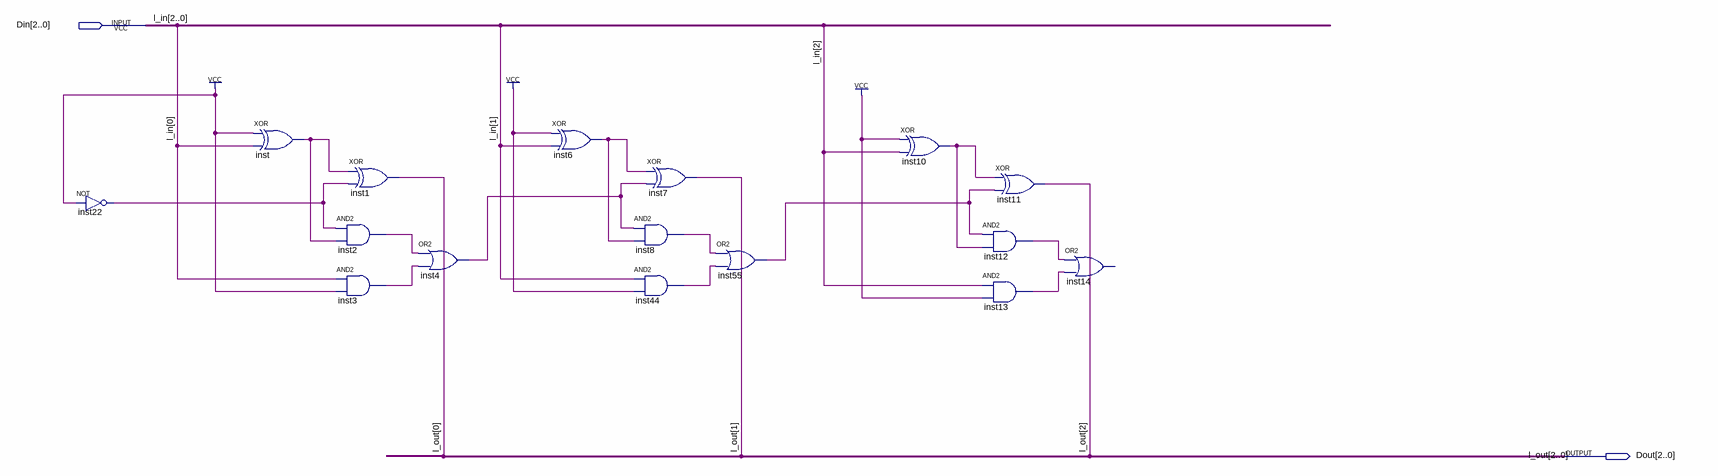
[diagram p0: schematic sheet]
// Quartus schematic decre_3bit.bdf as structural Verilog: 16 symbols, 2 pins
module decre_3bit (
  input  [2:0] Din,
  output [2:0] Dout
);

  wire inst2_out, inst3_out, inst4_out, inst6_out, inst8_out, inst10_out, inst12_out, inst13_out, inst22_out,
       inst44_out, inst55_out, inst_out;

  not inst22 (inst22_out, 1'b1);
  xor inst (inst_out, 1'b1, Din[0]);
  xor inst1 (Dout[0], inst_out, inst22_out);
  and inst2 (inst2_out, inst22_out, inst_out);
  and inst3 (inst3_out, Din[0], 1'b1);
  or inst4 (inst4_out, inst2_out, inst3_out);
  xor inst6 (inst6_out, 1'b1, Din[1]);
  and inst8 (inst8_out, inst4_out, inst6_out);
  and inst44 (inst44_out, Din[1], 1'b1);
  xor inst7 (Dout[1], inst6_out, inst4_out);
  or inst55 (inst55_out, inst8_out, inst44_out);
  xor inst10 (inst10_out, 1'b1, Din[2]);
  and inst12 (inst12_out, inst55_out, inst10_out);
  and inst13 (inst13_out, Din[2], 1'b1);
  xor inst11 (Dout[2], inst10_out, inst55_out);
  // OR2 inst14 has open pins: IN1=inst12_out, IN2=inst13_out, OUT=open

  // Other names for the same wires on the sheet: l_in[2:0] = Din; l_out[2:0] = Dout
endmodule
